# Altium schematic sheet Power Distribution - IO Expander.SchDoc: Title
size B; Organization: Midnight Sun Solar Rayce Car Team; Address1: University of Waterloo; Address2: 200 University Ave W; Address3: Waterloo, ON, Canada; Address4: N2L 3E9; Website: www.uwmidsun.com; ProjectName: ProjectName
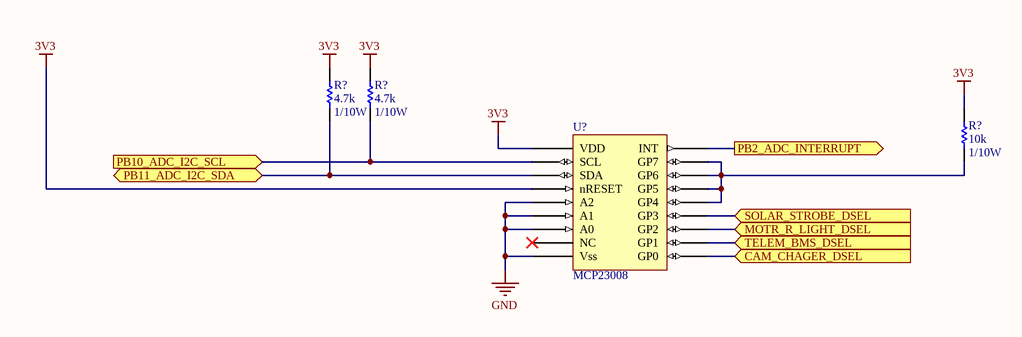
[diagram p0: Power Distribution - IO Expander.SchDoc]

## Parts
(Parts that share a designator on the sheet are numbered #1, #2 ... from top to bottom, then left to right.)
R?#1  Resistance (Ohms): 4.7k  Power (Watts): 1/10W  [RES, 0603]  (hidden comment: RES 4.7K OHM 1% 1/10W 0603)
R?#2  Resistance (Ohms): 4.7k  Power (Watts): 1/10W  [RES, 0603]  (hidden comment: RES 4.7K OHM 1% 1/10W 0603)
R?#3  Resistance: 10k  Power: 1/10W  [RES, 0603]  (hidden comment: RES 10K OHM 1% 1/10W 0603)
U?  MCP23008  [IC 18SOIC]

## Ports
CAM_CHAGER_DSEL (in), MOTR_R_LIGHT_DSEL (in), PB2_ADC_INTERRUPT (out), PB10_ADC_I2C_SCL (in), PB11_ADC_I2C_SDA (bidir), SOLAR_STROBE_DSEL (in), TELEM_BMS_DSEL (in)

## Nets
3V3: R?#1.1 R?#2.1 R?#3.1 U?.6(nRESET) U?.18(VDD)
GND: U?.3(A2) U?.4(A1) U?.5(A0) U?.9(Vss)
CAM_CHAGER_DSEL: U?.10(GP0) ; port CAM_CHAGER_DSEL
MOTR_R_LIGHT_DSEL: U?.12(GP2) ; port MOTR_R_LIGHT_DSEL
PB2_ADC_INTERRUPT: U?.8(INT) ; port PB2_ADC_INTERRUPT
PB10_ADC_I2C_SCL: R?#2.2 U?.1(SCL) ; port PB10_ADC_I2C_SCL
PB11_ADC_I2C_SDA: R?#1.2 U?.2(SDA) ; port PB11_ADC_I2C_SDA
SOLAR_STROBE_DSEL: U?.13(GP3) ; port SOLAR_STROBE_DSEL
TELEM_BMS_DSEL: U?.11(GP1) ; port TELEM_BMS_DSEL
NetR?#3_2: R?#3.2 U?.14(GP4) U?.15(GP5) U?.16(GP6) U?.17(GP7)

Not connected (* = marked no-connect by the designer): U? 7(NC)*

## Notes on the sheet
- PROJECT
- DOCUMENT
- DRAWN BY
- LAST MODIFIED
- PART NUMBER
- REVISION
- SHEET
- VARIANT
- OF
- Engineering 5 - 1002
  University of Waterloo
  (519) 888-4567 x32978
  hardware@uwmidsun.com

## Library data of the parts
R?#1 R?#2 = RES 4.7K OHM 1% 1/10W 0603: 4.7k Ohm ±1% 0.1W, 1/10W Chip Resistor 0603 (1608 Metric) Moisture Resistant Thick Film; Manufacturer 1: Yageo; Manufacturer Part Number 1: RC0603FR-074K7L; Description 1: RES SMD 4.7K OHM 1% 1/10W 0603; Temperature Coefficient: ±100ppm/°C; Supplier 1: Digi-Key; Supplier Part Number 1: 311-4.70KHRCT-ND; RoHS: RoHS Compliant; Category: Resistors; Stock 1: 3487566; Pricing 1: 1=0.16, 10=0.022, 100=0.0089, 1000=0.00402, 2500=0.00349 (CAD); Packaging: Cut Tape (CT); Part Status: Active; Composition: Thick Film; Features: Moisture Resistant; Operating Temperature: -55°C ~ 155°C; Package / Case: 0603 (1608 Metric); Supplier Device Package: 0603; Size / Dimension: 0.063" L x 0.031" W (1.60mm x 0.80mm); Height - Seated (Max): 0.022" (0.55mm); Failure Rate: -; ComponentLink1URL: http://www.yageo.com/documents/recent/PYu-RC_Group_51_RoHS_L_7.pdf; ComponentLink1Description: http://www.yageo.com/documents/recent/PYu-RC_Group_51_RoHS_L_7.pdf; Tolerance: ±1%
R?#3 = RES 10K OHM 1% 1/10W 0603: RES SMD 10K OHM 1% 1/10W 0603; Manufacturer 1: Yageo; Manufacturer Part Number 1: RC0603FR-0710KL; Temperature Coefficient: ±100ppm/°C; Supplier 1: Digi-Key; Supplier Part Number 1: 311-10.0KHRCT-ND; Packaging: Cut Tape (CT); Part Status: Active; Composition: Thick Film; Operating Temperature: -55°C ~ 155°C; Package / Case: 0603 (1608 Metric); Supplier Device Package: 0603; Size / Dimension: 0.063" L x 0.031" W (1.60mm x 0.80mm); Height - Seated (Max): 0.022" (0.55mm); Failure Rate: -; ComponentLink1URL: http://www.yageo.com/documents/recent/PYu-RC_Group_51_RoHS_L_7.pdf; ComponentLink1Description: http://www.yageo.com/documents/recent/PYu-RC_Group_51_RoHS_L_7.pdf; Tolerance: ±1%
U? = IC I/O EXPANDER I2C 8B 18SOIC: MCP23008 I/O Expander 8B+1Int 18P SOIC; Manufacturer: Microchip Technology; Manufacturer Part Number: MCP23008T-E/SO; Number of I/O: 8; Interface: I²C; Interrupt Output: Yes; Output Type: Push-Pull; Current - Output Source/Sink: 25mA; Voltage - Supply: 1.8 V ~ 5.5 V; Supplier 1: Digi-Key; Supplier Part Number 1: MCP23008T-E/SOCT-ND; RoHS: RoHS Compliant; Category: Integrated Circuits (ICs); Stock 1: 5607; Pricing 1: 1=1.62, 25=1.3548, 100=1.2431 (CAD); Packaging: Cut Tape (CT); Part Status: Active; Features: POR; Operating Temperature: -40°C ~ 125°C; Mounting Type: Surface Mount; Package / Case: 18-SOIC (0.295", 7.50mm Width); Supplier Device Package: 18-SOIC; ComponentLink1URL: http://www.microchip.com/mymicrochip/filehandler.aspx?ddocname=en021920; ComponentLink1Description: http://www.microchip.com/mymicrochip/filehandler.aspx?ddocname=en021920